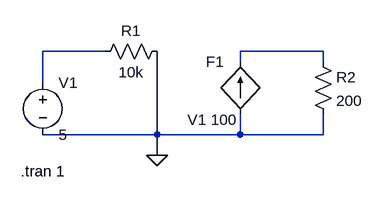
[diagram p0: schematic ex03-1.asc]
ex03-1.asc, the LTspice schematic file:
Version 4
SHEET 1 880 680
WIRE 96 80 0 80
WIRE 432 80 304 80
WIRE 304 96 304 80
WIRE 432 96 432 80
WIRE 0 128 0 80
WIRE 176 208 176 80
WIRE 176 208 0 208
WIRE 304 208 304 176
WIRE 304 208 176 208
WIRE 432 208 432 176
WIRE 432 208 304 208
WIRE 176 240 176 208
FLAG 176 240 0
SYMBOL voltage 0 112 R0
WINDOW 123 0 0 Left 0
WINDOW 39 0 0 Left 0
SYMATTR InstName V1
SYMATTR Value 5
SYMBOL res 192 64 R90
WINDOW 0 0 56 VBottom 2
WINDOW 3 32 56 VTop 2
SYMATTR InstName R1
SYMATTR Value 10k
SYMBOL f 304 176 R180
WINDOW 0 24 80 Left 2
WINDOW 3 5 -9 Left 2
SYMATTR InstName F1
SYMATTR Value V1 100
SYMBOL res 416 80 R0
SYMATTR InstName R2
SYMATTR Value 200
TEXT -34 264 Left 2 !.tran 1

The netlist it stands for:
* ex03-1.asc
V1 N001 0 5
R1 0 N001 10k
F1 0 N002 V1 100
R2 N002 0 200
.tran 1
.backanno
.end